# EAGLE schematic Example_B (EAGLE 8.2.1)

## Sheet 1 of 2
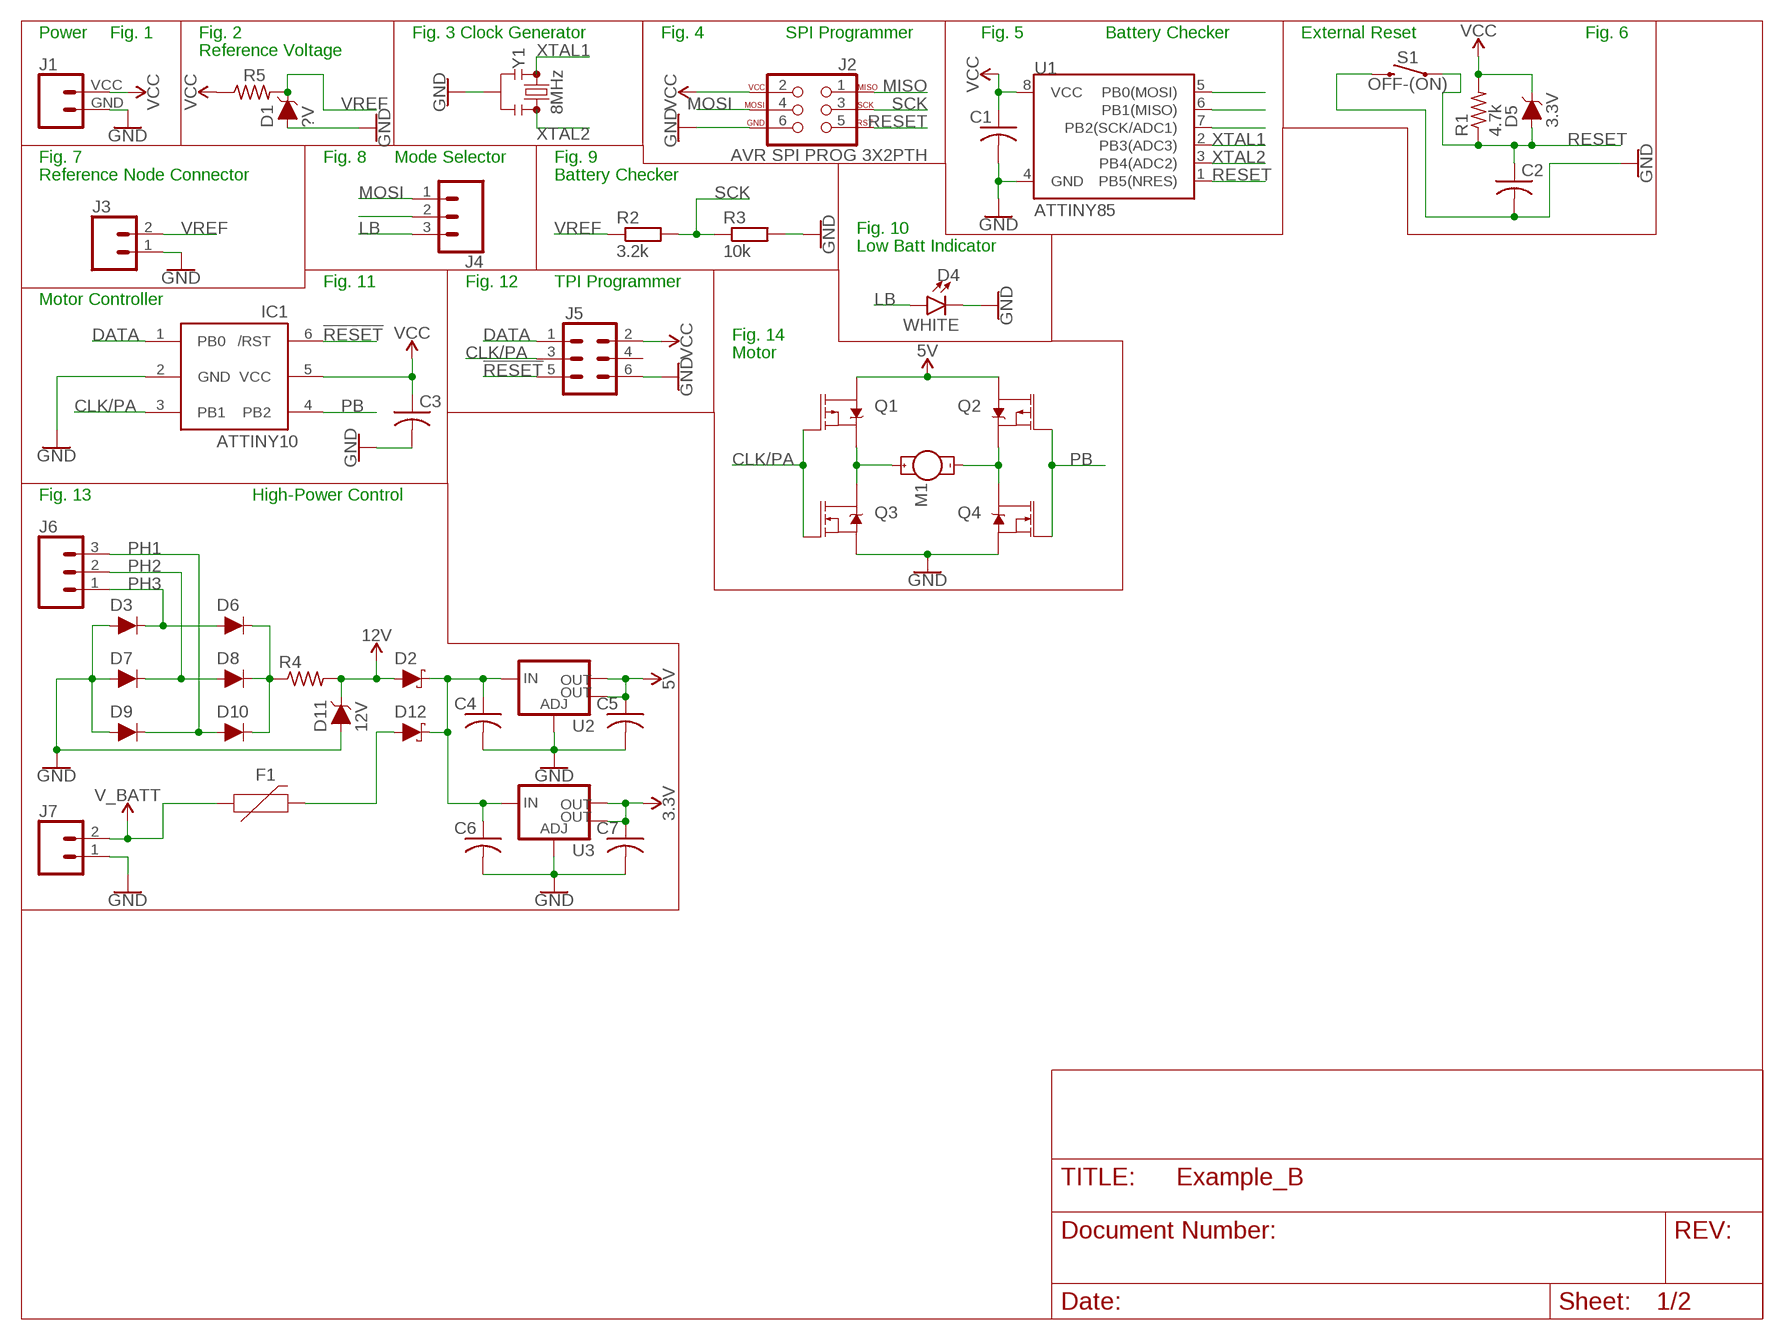
[diagram p0: schematic, sheet 1]

### Parts
C1  C-USC0805  [C0805]
C2  C-USC0805  [C0805]
C3  C-USC0805  [C0805]
C4  C-USC0805  [C0805]
C5  C-USC0805  [C0805]
C6  C-USC0805  [C0805]
C7  C-USC0805  [C0805]
D1  ?V  DIODE-ZENER-MMSZ5232BS  [SOD-323]
D2  DIODE-SCHOTTKY-SS14  [SMA-DIODE]
D3  DIODE-PTH  [DIODE-1N4001]
D4  WHITE  LED-WHITE1206  [LED-1206]
D5  3.3V  DIODE-ZENER-MMSZ5232BS  [SOD-323]
D6  DIODE-PTH  [DIODE-1N4001]
D7  DIODE-PTH  [DIODE-1N4001]
D8  DIODE-PTH  [DIODE-1N4001]
D9  DIODE-PTH  [DIODE-1N4001]
D10  DIODE-PTH  [DIODE-1N4001]
D11  12V  DIODE-ZENER-MMSZ5232BS  [SOD-323]
D12  DIODE-SCHOTTKY-SS14  [SMA-DIODE]
F1  PPTC_HALF-AMP  [1206]
IC1  ATTINY10  [SOT23-6]
J1  CONN_024UCON-15767  [JST-2-SMD-VERT]
J2  AVR SPI PROG 3X2PTH  AVR_SPI_PROG_3X2PTH  [2X3]
J3  CONN_02  [1X02]
J4  CONN_03  [1X03]
J5  CONN_03X22X3_SILK_MALE_PTH  [2X3]
J6  CONN_03  [1X03]
J7  CONN_02PTH3  [1X02_LONGPADS]
M1  MOTOR10MM  [VIBE-MOTOR-10MM]
Q1  MOSFET_PCH-SI2309DS  [SOT23-3]
Q2  MOSFET_PCH-SI2309DS  [SOT23-3]
Q3  MOSFET-NCH-FDD8780  [DPAK]
Q4  MOSFET-NCH-FDD8780  [DPAK]
R1  4.7k  R-US_R0805  [R0805]
R2  3.2k  R-EU_R0805  [R0805]
R3  10k  R-EU_R0805  [R0805]
R4  R-US_R0805  [R0805]
R5  R-US_R0805  [R0805]
S1  OFF-(ON)  MOMENTARY-SWITCH-SPST-SMD-5.2MM  [TACTILE_SWITCH_SMD_5.2MM]
U1  ATTINY85  ATTINY45TINY85-20-DIP  [DIP08_MCU]
U2  V_REG_LM1117SOT223  [SOT223]
U3  V_REG_LM1117SOT223  [SOT223]
Y1  8MHz  RESONATOR-8MHZSMD_3.2X1.3  [RESONATOR-SMD-3.2X1.3]

### Nets
3.3V: C7.1 U3.2(OUT) U3.4(OUT)
5V: C5.1 Q1.3(D) Q2.3(D) U2.2(OUT) U2.4(OUT)
12V: D2.A D11.C R4.2
!RESET: IC1.6(/RST) J5.5
CLK/PA: IC1.3(PB1) J5.3 Q1.1(G) Q3.1(G)
DATA: IC1.1(PB0) J5.1
GND: C1.2 C2.2 C3.2 C4.2 C5.2 C6.2 C7.2 D1.A D3.A D4.C D7.A D9.A D11.A IC1.2(GND) J1.GND J2.6 J3.1 J5.6 J7.1 Q3.3(S) Q4.3(S) R3.2 S1.3 U1.4(GND) U2.1(ADJ) U3.1(ADJ) Y1.2
LB: D4.A J4.3
MISO: J2.1 U1.6(PB1(MISO))
MOSI: J2.4 J4.1 U1.5(PB0(MOSI))
N$1: J4.2
N$2: M1.+ Q1.2(S) Q3.4(D)
N$3: M1.- Q2.2(S) Q4.4(D)
N$4: D6.C D8.C D10.C R4.1
N$7: C4.1 C6.1 D2.C D12.C U2.3(IN) U3.3(IN)
N$8: D12.A F1.2
PB: IC1.4(PB2) Q2.1(G) Q4.1(G)
PH1: D9.C D10.A
PH2: D7.C D8.A
PH3: D3.C D6.A
RESET: C2.1 D5.A J2.5 R1.1 S1.1 U1.1(PB5(NRES))
SCK: J2.3 R2.2 R3.1 U1.7(PB2(SCK/ADC1))
V_BATT: F1.1 J7.2
VCC: C1.1 C3.1 D5.C IC1.5(VCC) J1.VCC J2.2 J5.2 R1.2 R5.1 U1.8(VCC)
VREF: D1.C J3.2 R2.1 R5.2
XTAL1: U1.2(PB3(ADC3)) Y1.1
XTAL2: U1.3(PB4(ADC2)) Y1.3
Unconnected: J5.4 J6.1 J6.2 J6.3

### Notes on the sheet
- Power | Fig. 1 | Fig. 2 | Fig. 3 Clock Generator | Fig. 4 | SPI Programmer | Fig. 5 | Battery Checker | External Reset | Fig. 6
- Reference Voltage
- Fig. 7 | Fig. 8 | Mode Selector | Fig. 9
- Reference Node Connector | Battery Checker
- Fig. 10
- Low Batt Indicator
- Fig. 11 | Fig. 12 | TPI Programmer
- Motor Controller
- Fig. 14
- Motor
- Fig. 13 | High-Power Control

## Sheet 2 of 2
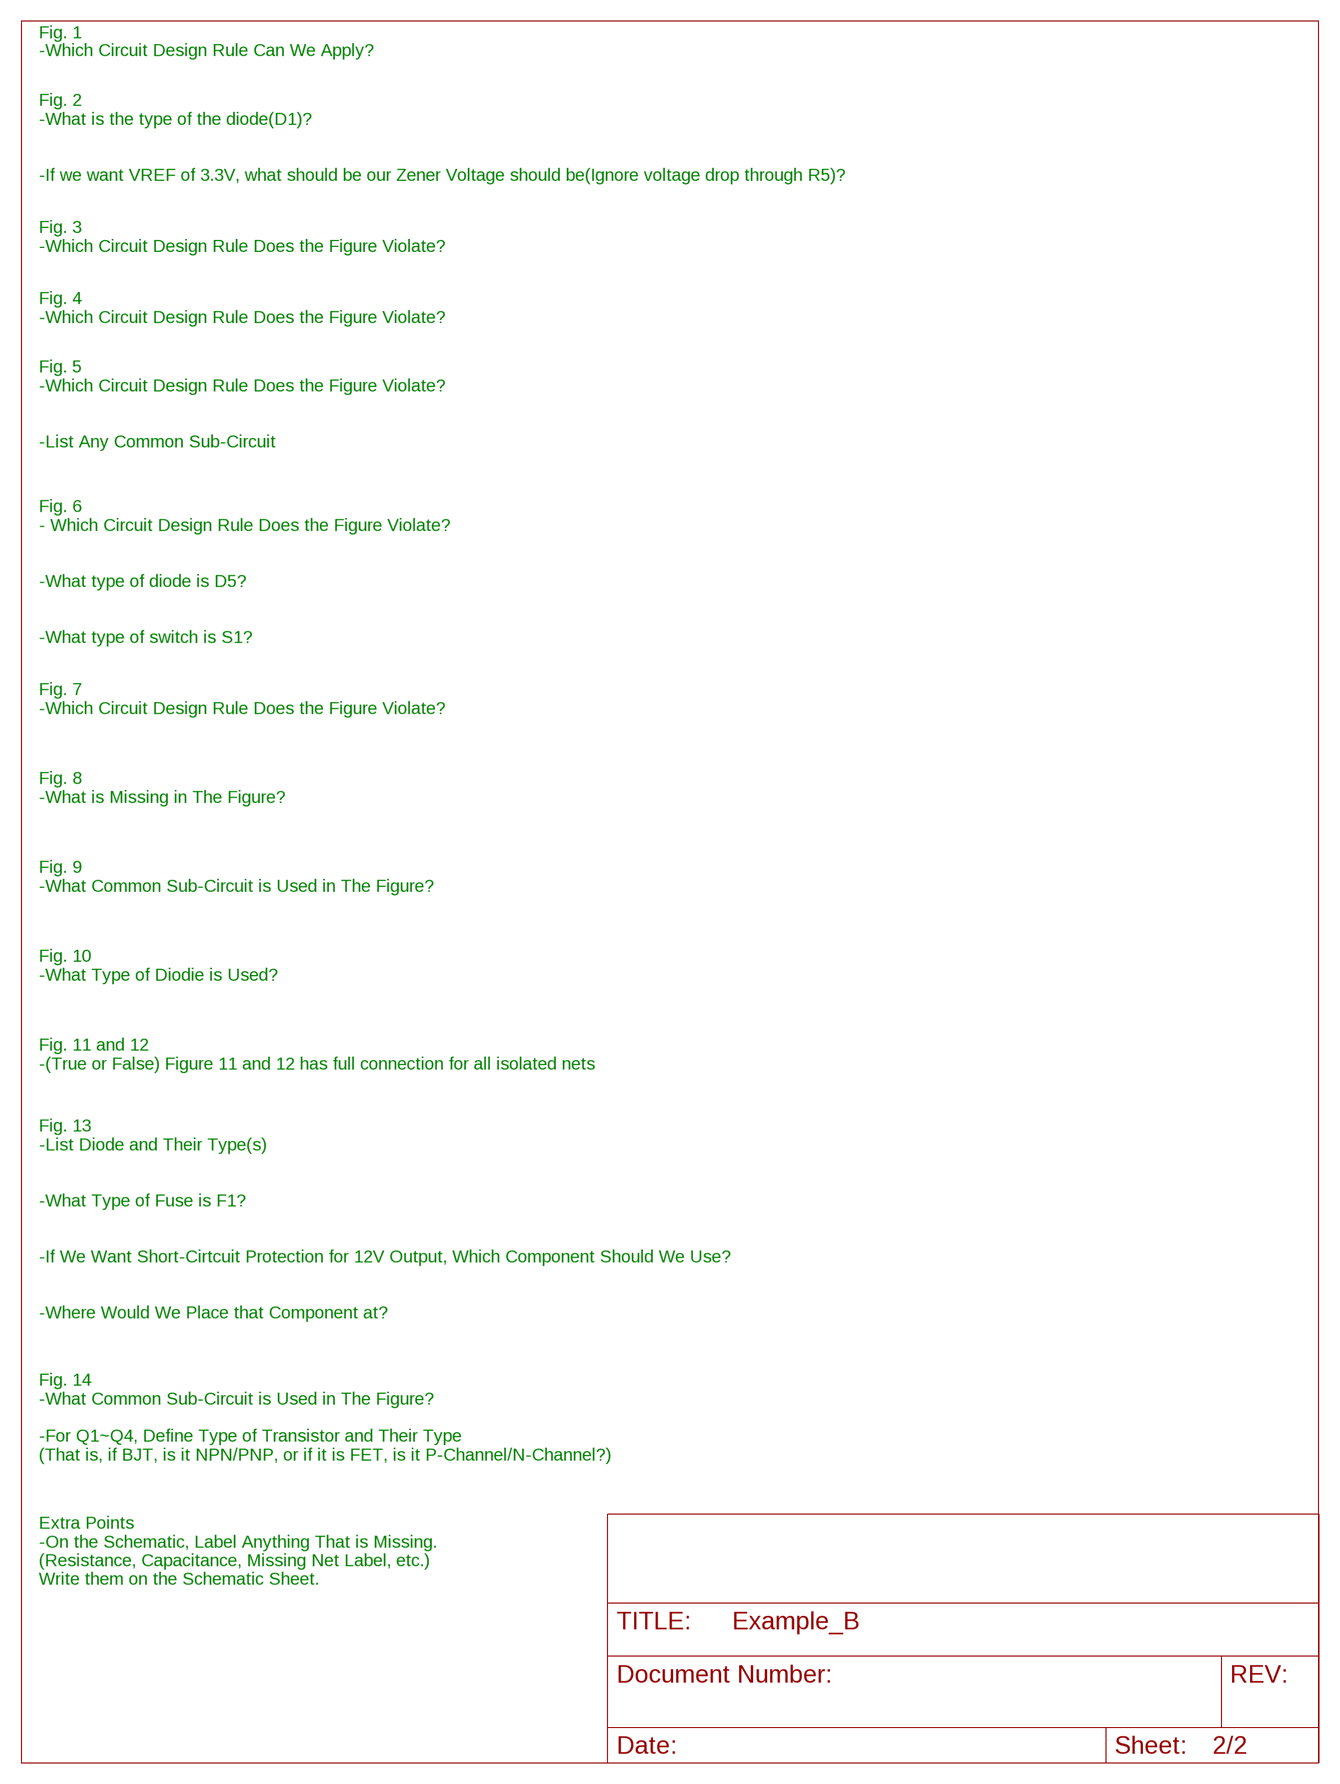
[diagram p1: schematic, sheet 2]

### Notes on the sheet
- Fig. 1
- -Which Circuit Design Rule Can We Apply?
- Fig. 2
  -What is the type of the diode(D1)?
  
  
  -If we want VREF of 3.3V, what should be our Zener Voltage should be(Ignore voltage drop through R5)?
- Fig. 3
  -Which Circuit Design Rule Does the Figure Violate?
- Fig. 4
  -Which Circuit Design Rule Does the Figure Violate?
- Fig. 5
  -Which Circuit Design Rule Does the Figure Violate?
  
  
  -List Any Common Sub-Circuit
- Fig. 6
  - Which Circuit Design Rule Does the Figure Violate?
  
  
  -What type of diode is D5?
  
  
  -What type of switch is S1?
- Fig. 7
  -Which Circuit Design Rule Does the Figure Violate?
- Fig. 8
  -What is Missing in The Figure?
- Fig. 9
  -What Common Sub-Circuit is Used in The Figure?
- Fig. 10
  -What Type of Diodie is Used?
- Fig. 11 and 12
  -(True or False) Figure 11 and 12 has full connection for all isolated nets
- Fig. 13
  -List Diode and Their Type(s)
  
  
  -What Type of Fuse is F1?
  
  
  -If We Want Short-Cirtcuit Protection for 12V Output, Which Component Should We Use?
  
  
  -Where Would We Place that Component at?
- Fig. 14
  -What Common Sub-Circuit is Used in The Figure?
  
  -For Q1~Q4, Define Type of Transistor and Their Type
  (That is, if BJT, is it NPN/PNP, or if it is FET, is it P-Channel/N-Channel?)
- Extra Points
  -On the Schematic, Label Anything That is Missing.
  (Resistance, Capacitance, Missing Net Label, etc.)
  Write them on the Schematic Sheet.

## Library data of the parts
C1-C7 = rcl:C-US: CAPACITOR, American symbol
D1 D5 D11 = SparkFun-DiscreteSemi:DIODE-ZENER: Zener Diode A Zener diode allows current to flow from its anode to its cathode like a normal semiconductor diode, but it also permits current to flow in the reverse direction when its "Zener voltage" is reached. - WIkipedia; PROD_ID: DIO-12442; VALUE: 5.6V
D2 D12 = SparkFun-DiscreteSemi:DIODE-SCHOTTKY: Schottky diode A Schottky diode is a semiconductor diode which has a low forward voltage drop and a very fast switching action.; PROD_ID: DIO-08053; VALUE: 1A/40V/500mV
D3 D6-D10 = SparkFun-DiscreteSemi:DIODE: Diode These are standard reverse protection diodes and small signal diodes. SparkFun Products: SparkFun SparkPunk Sound Kit <https://www.sparkfun.com/products/11177> SparkFun ESP8266 Thing <https://www.sparkfun.com/products/13231>; PROD_ID: DIO-09176; VALUE: 1A/50V/1.1V
D4 = SparkFun-LED:LED-WHITE: White SMD LED Used in manufacturing several products at SparkFun. Packages: 0603 - Bright White SMD 0603 package[Product Link] <http://www.kingbrightusa.com/product.asp?catalog_name=LED&product_id=APT1608QWF/D> 1206 - Bright White SMD1206 package [Product Link] <http://www.kingbrightusa.com/product.asp?catalog_name=LED&product_id=APT3216QWF/D> SparkFun Products: Blackberry Trackballer Breakout <https://www.sparkfun.com/products/13169> Digital SandBox <https://www.sparkfun.com/products/12651>; PROD_ID: DIO-09955
F1 = SparkFun-Fuses:PPTC: Resettable Fuse PPTC Resettable Fuse. Really a sort of resistor with a polymeric positive temperature coefficient whose resistance increases dramatically with an increase in temperature. When heated by the power passing through the resistance rises causing the current to be limited, protecting the circuit. This is achieved by the transition of the polymer from a crystalline to an amorphous state where the conductive carbon separates breaking the conductive pathways found in the cool crystalline structure. When a PPTC cools back down it resumes conducting letting the circuit turn back on. SparkFun Products: SparkFun RedBoard - Programmed with Arduino <https://www.sparkfun.com/products/12757> Pro Micro - 5V/16MHz <https://www.sparkfun.com/products/12640> Arduino Pro 328 - 5V/16MHz <https://www.sparkfun.com/products/10915> MP3 Trigger <https://www.sparkfun.com/products/13720>; PROD_ID: RES-08585; VALUE: 6V/0.5A
IC1 = adafruit:ATTINY10: ATtiny4/5/9/10 8-bit Microcontroller with 512/1024 Bytes In-System Programmable Flash
J1 J3 J7 = SparkFun-Connectors:CONN_02: Multi connection point. Often used as Generic Header-pin footprint for 0.1 inch spaced/style header connections On any of the 0.1 inch spaced packages, you can populate with these: Break Away Headers - Straight <https://www.sparkfun.com/products/116> (PRT-00116) Break Away Male Headers - Right Angle <https://www.sparkfun.com/products/553> (PRT-00553) Female Headers <https://www.sparkfun.com/products/115> (PRT-00115) Break Away Headers - Machine Pin <https://www.sparkfun.com/products/117> (PRT-00117) Break Away Female Headers - Swiss Machine Pin <https://www.sparkfun.com/products/743> (PRT-00743) For SCREWTERMINALS and SPRING TERMINALS visit here: Screw Terimnals on SparkFun.com <https://www.sparkfun.com/search/results?term=Screw+Terminals> (5mm/3.5mm/2.54mm spacing) This device is also useful as a general connection point to wire up your design to another part of your project. Our various solder wires solder well into these plated through hole pads. Hook-Up Wire - Assortment (Stranded, 22 AWG) <https://www.sparkfun.com/products/11375> (PRT-11375) Hook-Up Wire - Assortment (Solid Core, 22 AWG) <https://www.sparkfun.com/products/11367> (PRT-11367) View the entire wire category on our website here <https://www.sparkfun.com/categories/141> Special notes: Molex polarized connector foot print use with: PRT-08233 with associated crimp pins and housings. 2.54_SCREWTERM for use with PRT-10571. 3.5mm Screw Terminal footprints for PRT-08084 5mm Screw Terminal footprints for use with PRT-08432
J2 = SparkFun-Connectors:AVR_SPI_PROG_3X2: AVR ISP 6 Pin This is the reduced ISP connector for AVR programming. Common on Arduino. This footprint will take up less PCB space and can be used with a 10-pin to 6-pin adapter such as SKU: BOB-08508 **Special note about "TEST_POINT" package. The stop mask is on the top side, so if you want your programming test points to be on the bottom of your board, make sure to place this package on the bottom side of the board. This also ensure that the orientation to program from the bottom side will be correct. SparkFun Products: SparkFun ISP Pogo Adapter <https://www.sparkfun.com/products/11591> - NS Tiny AVR Programmer <https://www.sparkfun.com/products/11801> -PTH
J4 J6 = SparkFun-Connectors:CONN_03: Multi connection point. Often used as Generic Header-pin footprint for 0.1 inch spaced/style header connections On any of the 0.1 inch spaced packages, you can populate with these: Break Away Headers - Straight <https://www.sparkfun.com/products/116> (PRT-00116) Break Away Male Headers - Right Angle <https://www.sparkfun.com/products/553> (PRT-00553) Female Headers <https://www.sparkfun.com/products/115> (PRT-00115) Break Away Headers - Machine Pin <https://www.sparkfun.com/products/117> (PRT-00117) Break Away Female Headers - Swiss Machine Pin <https://www.sparkfun.com/products/743> (PRT-00743) Stackable Header - 3 Pin (Female, 0.1") <https://www.sparkfun.com/products/13875> (PRT-13875) For SCREWTERMINALS and SPRING TERMINALS visit here: Screw Terimnals on SparkFun.com <https://www.sparkfun.com/search/results?term=Screw+Terminals> (5mm/3.5mm/2.54mm spacing) This device is also useful as a general connection point to wire up your design to another part of your project. Our various solder wires solder well into these plated through hole pads. Hook-Up Wire - Assortment (Stranded, 22 AWG) <https://www.sparkfun.com/products/11375> (PRT-11375) Hook-Up Wire - Assortment (Solid Core, 22 AWG) <https://www.sparkfun.com/products/11367> (PRT-11367) View the entire wire category on our website here <https://www.sparkfun.com/categories/141> Special notes: Molex polarized connector foot print use with SKU : PRT-08232 with associated crimp pins and housings.
J5 = SparkFun-Connectors:CONN_03X2: Multi connection point. Often used as Generic Header-pin footprint for 0.1 inch spaced/style header connections You can populate with any combo of single row headers, but if you'd like an exact match, check these: Header - 2x3 (Male, 0.1") <https://www.sparkfun.com/products/12807> (PRT-12807) Header - 2x3 (Female, 0.1") <https://www.sparkfun.com/products/13010> (PRT-13010) 2x3 Pin Shrouded Header <https://www.sparkfun.com/products/10877> (PRT-10877) On any of the 0.1 inch spaced packages, you can populate with these: Break Away Headers - Straight <https://www.sparkfun.com/products/116> (PRT-00116) Break Away Male Headers - Right Angle <https://www.sparkfun.com/products/553> (PRT-00553) Female Headers <https://www.sparkfun.com/products/115> (PRT-00115) Break Away Headers - Machine Pin <https://www.sparkfun.com/products/117> (PRT-00117) Break Away Female Headers - Swiss Machine Pin <https://www.sparkfun.com/products/743> (PRT-00743) Special note: the shrouded connector mates well with our 3x2 ribbon cables: Ribbon Crimp Connector - 6-pin (2x3, Female) <https://www.sparkfun.com/products/10651> (PRT-10651) Ribbon Cable - 6 wire (15ft) <https://www.sparkfun.com/products/10646> (PRT-10646); PROD_ID: CONN-09701
M1 = SparkFun-Electromechanical:MOTOR: Motor (Single-Phase) Two-terminal, single-phase motors. SparkFun Products Vibration Motor <https://www.sparkfun.com/products/8449> (ROB-08449) Physical dimension and wire connections for this powerful vibration motor. Motor has a self adhesive backing.; PROD_ID: COMP-08572; SF_SKU: ROB-08449
Q1 Q2 = SparkFun-DiscreteSemi:MOSFET_PCH: P-channel MOSFETs Voltage controlled devices that allow control of high current outputs. SparkFun Products: SparkFun ESP32 Thing <https://www.sparkfun.com/products/13907> SparkFun ESP8266 Thing <https://www.sparkfun.com/products/13231>; PROD_ID: TRANS-08285; VALUE: 1.1A/60V/600mΩ
Q3 Q4 = SparkFun-DiscreteSemi:MOSFET-NCH: N-channel MOSFETs Voltage controlled devices that allow control of high current outputs. SparkFun Products: SparkFun OpenScale <https://www.sparkfun.com/products/13261> SparkFun Digital Sandbox <https://www.sparkfun.com/products/12651> SparkFun Monster Moto Shield <https://www.sparkfun.com/products/10182> SparkFun MOSFET Power Controller <https://www.sparkfun.com/products/11214>; PROD_ID: TRANS-09984; VALUE: 35A/25V/8.5mΩ
R1 R4 R5 = rcl:R-US_: RESISTOR, American symbol
R2 R3 = rcl:R-EU_: RESISTOR, European symbol
S1 = SparkFun-Switches:MOMENTARY-SWITCH-SPST: Momentary Switch (Pushbutton) - SPST Normally-open (NO) SPST momentary switches (buttons, pushbuttons). Variants PTH-12MM - 12mm square, through-hole Momentary Pushbutton Switch - 12mm Square <https://www.sparkfun.com/products/9190> (COM-09190) PTH-6.0MM, PTH-6.0MM-KIT - 6.0mm square, through-hole Mini Pushbutton Switch <https://www.sparkfun.com/products/97> (COM-00097) KIT package intended for soldering kit's - only one side of pads' copper is exposed. PTH-RIGHT-ANGLE-KIT - Right-angle, through-hole Right Angle Tactile Button <https://www.sparkfun.com/products/10791> - Used on SparkFun BigTime Watch Kit <https://www.sparkfun.com/products/11734> SMD-12MM - 12mm square, surface-mount Tactile Button - SMD (12mm) <https://www.sparkfun.com/products/12993> (COM-12993) Used on SparkFun PicoBoard <https://www.sparkfun.com/products/11888> SMD-4.5MM - 4.5mm Square Trackball Switch Used on SparkFun Blackberry Trackballer Breakout <https://www.sparkfun.com/products/13169> SMD-4.6MMX2.8MM - 4.60mm x 2.80mm, surface mount Used on SparkFun SAMD21 Mini Breakout <https://www.sparkfun.com/products/13664> SMD-5.2MM, SMD-5.2-REDUNDANT - 5.2mm square, surface-mount Mini Pushbutton Switch - SMD <https://www.sparkfun.com/products/8720> (COM-08720) Used on Arduino Pro Mini <https://www.sparkfun.com/products/11114> REDUNDANT package connects both switch circuits together SMD-6.0X3.5MM - 6.0 x 3.5mm, surface mount Momentary Reset Switch SMD <https://www.sparkfun.com/products/8229> (COM-08229) SMD-6.2MM-TALL - 6.2mm square, surface mount Tactile Button - SMD (6mm) <https://www.sparkfun.com/products/12992> Used on SparkFun Digital Sandbox <https://www.sparkfun.com/products/12651> SMD-RIGHT-ANGLE - Right-angle, surface mount Used on SparkFun Block for Intel® Edison - Arduino <https://www.sparkfun.com/products/13036>; PROD_ID: SWCH-08247; SF_SKU: COM-08720
U1 = SparkFun-Retired:ATTINY45: Atmel 8-pin 2/4/8kB flash uC Retired; PROD_ID: IC-09445; VALUE: TINY85-20-DIP
U2 U3 = SparkFun-IC-Power:V_REG_LM1117: Voltage Regulator LM1117 Standard adjustable voltage regulator but in SMD form. Spark Fun Electronics SKU : COM-00595; PROD_ID: VREG-08170
Y1 = SparkFun-Clocks:RESONATOR-8MHZ: 8MHz Resonator Digikey Example <http://www.digikey.com/product-detail/en/murata-electronics-north-america/CSTCE10M0G55-R0/490-1196-1-ND/584633> Frequency: 8MHz Frequency Stability: ±0.2% Frequency Tolerance: ±0.5% Capacitance: 33pF SparkFun Products Arduino Pro Mini 328- 3.3V/8MHz <https://www.sparkfun.com/products/11114> SparkFun Digital Sandbox <https://www.sparkfun.com/products/12651>; PROD_ID: XTAL-08895